# Altium schematic sheet DW3000.SchDoc
size 254 x 203 mm
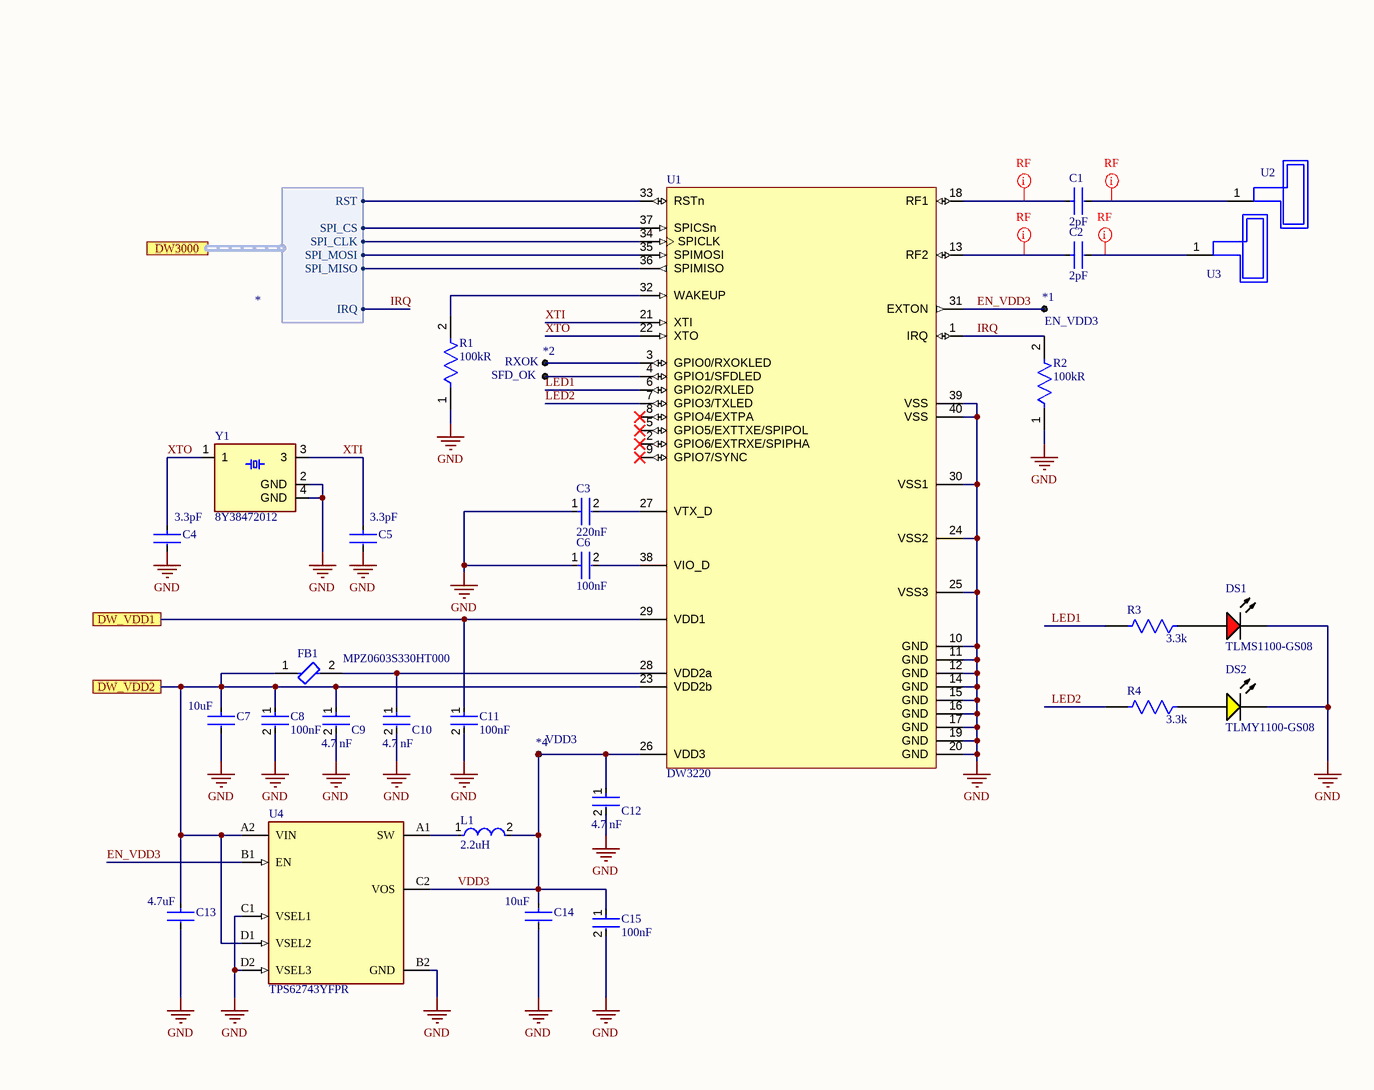
[diagram p0: DW3000.SchDoc]

## Parts
*1  EN_VDD3  [Pad-0.6mm]  (no BOM)
*2  RXOK  [Pad-1mm]  (no BOM)
*3  SFD_OK  [Pad-1mm]  (no BOM)
*4  VDD3  [Pad-0.6mm]  (no BOM)
C1  Capacitance: 2pF  [FP-GJM033-0_03-IPC_B]  (hidden comment: GJM0335C1E2R0WB01D)
C2  Capacitance: 2pF  [FP-GJM033-0_03-IPC_B]  (hidden comment: GJM0335C1E2R0WB01D)
C3  Capacitance: 220nF  [FP-GRM155-0_05-IPC_C]  (hidden comment: GRM155R71C224KA12D)
C4  Capacitance: 3.3pF  [FP-GJM155-0_05-IPC_C]  (hidden comment: GJM1555C1H3R3BB01D)
C5  Capacitance: 3.3pF  [FP-GJM155-0_05-IPC_C]  (hidden comment: GJM1555C1H3R3BB01D)
C6  Capacitance: 100nF  [FP-GRM155-0_05-IPC_B]  (hidden comment: GRM155R71E104ME14D)
C7  Capacitance: 10uF  [FP-GRM155-0_2-0_1-IPC_C]  (hidden comment: GRM155R60J106ME47D)
C8  Capacitance: 100nF  [FP-GRM155-0_05-IPC_B]  (hidden comment: GRM155R71E104ME14D)
C9  Parameter 1: 4.7 nF  [FP-GRM155-0_15-IPC_B]  (hidden comment: GRM1555C1H472GE01D)
C10  Parameter 1: 4.7 nF  [FP-GRM155-0_15-IPC_B]  (hidden comment: GRM1555C1H472GE01D)
C11  Capacitance: 100nF  [FP-GRM155-0_05-IPC_B]  (hidden comment: GRM155R71E104ME14D)
C12  Parameter 1: 4.7 nF  [FP-GRM155-0_15-IPC_B]  (hidden comment: GRM1555C1H472GE01D)
C13  Capacitance: 4.7uF  [FP-GRM155-0_15-IPC_B]  (hidden comment: GRM155C80J475MEAAD)
C14  Capacitance: 10uF  [FP-GRM155-0_2-0_1-IPC_C]  (hidden comment: GRM155R60J106ME47D)
C15  Capacitance: 100nF  [FP-GRM155-0_05-IPC_B]  (hidden comment: GRM155R71E104ME14D)
DS1  TLMS1100-GS08  [VISH-TLMX1100_V]
DS2  TLMY1100-GS08  [VISH-TLMX1100-2_V]
FB1  MPZ0603S330HT000  [FP-MPZ0603-IPC_B]
L1  Inductance: 2.2uH  [FP-DFE201610C-IPC_C]  (hidden comment: 1285AS-H-2R2M=P2)
R1  Resistance: 100kR  [FP-CRCW0402-e3-IPC_C]  (hidden comment: CRCW0402100KFKED)
R2  Resistance: 100kR  [FP-CRCW0402-e3-IPC_C]  (hidden comment: CRCW0402100KFKED)
R3  Resistance: 3.3k  [FP-CRCW0402-e3-IPC_C]
R4  Resistance: 3.3k  [FP-CRCW0402-e3-IPC_C]
U1  DW3220  [QFN40P500X500X40_HS-40N]
U2  AH086M555003-T  [AH086M]  (value not drawn)
U3  AH086M555003-T  [AH086M]  (value not drawn)
U4  TPS62743YFPR  [FP-YFP0008-C01-MFG]
Y1  8Y38472012  [OSCSC320X250X100N]

## Ports
DW3000 (harness *), DW_VDD1, DW_VDD2

## Harnesses
*: SPI_CS, SPI_CLK, SPI_MOSI, SPI_MISO, RST, IRQ

## Nets
GND: C3.1 C4.2 C5.2 C6.1 C7.2 C8.2 C9.2 C10.2 C11.2 C12.2 C13.2 C14.2 C15.2 DS1.2(K) DS2.2(K) R1.1 R2.1 U1.10(GND) U1.11(GND) U1.12(GND) U1.14(GND) U1.15(GND) U1.16(GND) U1.17(GND) U1.19(GND) U1.20(GND) U1.24(VSS2) U1.25(VSS3) U1.30(VSS1) U1.39(VSS) U1.40(VSS) U4.B2(GND) U4.C1(VSEL1) U4.D2(VSEL3) Y1.2(GND) Y1.4(GND)
DW_VDD1: C11.1 U1.29(VDD1) ; port DW_VDD1
DW_VDD2: C7.1 C8.1 C9.1 C13.1 FB1.1 U1.23(VDD2b) U4.A2(VIN) U4.D1(VSEL2) ; port DW_VDD2
EN_VDD3: *1.1 U1.31(EXTON) U4.B1(EN)
IRQ: R2.2 U1.1(IRQ) ; port DW3000.IRQ
LED1: R3.2 U1.6(GPIO2/RXLED)
LED2: R4.2 U1.7(GPIO3/TXLED)
VDD3: *4.1 C12.1 C14.1 C15.1 L1.2 U1.26(VDD3) U4.C2(VOS)
XTI: C5.1 U1.21(XTI) Y1.3
XTO: C4.1 U1.22(XTO) Y1.1
Net*2_1: *2.1 U1.3(GPIO0/RXOKLED)
Net*3_1: *3.1 U1.4(GPIO1/SFDLED)
NetC1_1: C1.1 U1.18(RF1)
NetC1_2: C1.2 U2.1
NetC2_1: C2.1 U1.13(RF2)
NetC2_2: C2.2 U3.1
NetC3_2: C3.2 U1.27(VTX_D)
NetC6_2: C6.2 U1.38(VIO_D)
NetC10_1: C10.1 FB1.2 U1.28(VDD2a)
NetDS1_1: DS1.1(A) R3.1
NetDS2_1: DS2.1(A) R4.1
NetL1_1: L1.1 U4.A1(SW)
NetR1_2: R1.2 U1.32(WAKEUP)
NetU1_33: U1.33(RSTn) ; port DW3000.RST
NetU1_34: U1.34(SPICLK) ; port DW3000.SPI_CLK
NetU1_35: U1.35(SPIMOSI) ; port DW3000.SPI_MOSI
NetU1_36: U1.36(SPIMISO) ; port DW3000.SPI_MISO
NetU1_37: U1.37(SPICSn) ; port DW3000.SPI_CS

Not connected (* = marked no-connect by the designer): U1 2(GPIO6/EXTRXE/SPIPHA)* 5(GPIO5/EXTTXE/SPIPOL)* 8(GPIO4/EXTPA)* 9(GPIO7/SYNC)*

## Layout directives
net class RF: NetC1_1, NetC1_2, NetC2_1, NetC2_2

## Notes on the sheet
- 1
- 2
- 3
- 4
- A
- B
- C
- Project:
- D
- Date:
- Drawing number:
- Rev:
- Format:
- A4 Q
- Drawn by:
- Laboratory:
- Page
- Sheet:
- of
- File:

## Library data of the parts
*1 *4 = CMP-00224-1: 0.6mm SMT Test Pad; Mounting Technology: SMT
*2 *3 = CMP-01283-1: 1mm SMT Test Pad; Mounting Technology: SMT
C1 C2 = CMP-2010-00751-2: Ceramic Capacitor 2pF ±0.05pF 25V C0G 0201 (0603 Metric); Package Quantity: 15000; Min Operating Temperature: -55°C; Thickness: 0.013inch; Max Operating Temperature: 125°C; Voltage Rating: 25V; Voltage Rating (DC): 25V; Packaging: Tape and Reel; Width: 0.012inch; Length: 0.6mm; Height: 0.3mm; Mount: Surface Mount; Case Code (Imperial): 0201; Radiation Hardening: No; Dielectric: C0G; Termination: SMD/SMT; Case Code (Metric): 0603; Case/Package: 0201; Depth: 0.3mm
C3 = CMP-1034-02089-3: Chip Multilayer Ceramic Capacitors for General Purpose, 0402, 0.22uF, X7R, 15%, 10%, 16V; Depth: 0.5mm; Dielectric: X7R; Min Operating Temperature: -55°C; Package Quantity: 1; Termination: SMD/SMT; Mount: Surface Mount; Radiation Hardening: No; Height: 0.5mm; Case Code (Metric): 1005; Packaging: Tape and Reel; Material: Ceramic; Voltage: 16V; Voltage Rating (DC): 16V; REACH SVHC: No SVHC; Voltage Rating: 16V; Length: 1mm; Tolerance: 10%; Thickness: 0.022inch; Case Code (Imperial): 0402; Max Operating Temperature: 125°C; Width: 0.02inch; Lead Free: Lead Free; Case/Package: 0402
C4 C5 = CMP-2008-03846-2: Multi-Layer Ceramic Capacitor 3.3pF C0G  ±0.1pF 0402 Paper T/R; Voltage: 50V; Lead Free: Lead Free; Thickness: 0.022inch; Mount: Surface Mount; Termination: SMD/SMT; Package Quantity: 1; Lead Pitch: 0.3mm; Case/Package: 0402; REACH SVHC: No SVHC; Case Code (Imperial): 0402; Number of Pins: 2; Height: 0.5mm; Width: 0.5mm; Depth: 0.5mm; Packaging: Tape and Reel; Min Operating Temperature: -55°C; Length: 1mm; Dielectric: C0G; Case Code (Metric): 1005; Max Operating Temperature: 125°C; Voltage Rating (DC): 50V; Voltage Rating: 50V; Radiation Hardening: No
C6 C8 C11 C15 = CMP-06035-053616-1: Chip Multilayer Ceramic Capacitors for General Purpose, 0402, 0.10uF, X7R, 15%, 20%, 25V; Dielectric: X7R; Width: 0.5mm; Case/Package: 0402; Package Quantity: 10000; Lead Free: Lead Free; Voltage Rating (DC): 25V; Max Operating Temperature: 125°C; Depth: 0.5mm; Packaging: Tape and Reel; Length: 1mm; Case Code (Metric): 1005; Tolerance: 20%; Case Code (Imperial): 0402; Thickness: 0.022inch; Material: Ceramic; Voltage Rating: 25V; Weight: 0.000212oz; Min Operating Temperature: -55°C; Termination: SMD/SMT; Mount: Surface Mount; Resistor Type: Ceramic; Height: 0.5mm
C7 C14 = CMP-06035-022355-1: Chip Multilayer Ceramic Capacitors for General Purpose, 0402, 10uF, X5R, 15%, 20%, 6.3V; Mount: Surface Mount; Tolerance: 20%; Width: 0.02inch; Voltage Rating: 6.3V; Length: 0.039inch; Case Code (Imperial): 0402; Voltage Rating (DC): 6.3V; Max Operating Temperature: 85°C; Thickness: 0.024inch; Min Operating Temperature: -55°C; Packaging: Tape and Reel; Case/Package: 0402; Dielectric: X5R; Case Code (Metric): 1005
C9 C10 C12 = CMP-06035-019672-1: Chip Multilayer Ceramic Capacitors for General Purpose, 0402, 4700pF, C0G, 30ppm/°C, 2%, 50V
C13 = CMP-06035-032730-1: Chip Multilayer Ceramic Capacitors for General Purpose, 0402, 4.7uF, X6S, 22%, 20%, 6.3V; Dielectric: X6S; Length: 1mm; Tolerance: 20%; Voltage Rating (DC): 6.3V; Width: 500um; Thickness: 500um
DS1 = CMP-1666-00027-1: LED, RED, 2.1 V, -40 to 100 degC, 2-Pin SMD (0603), RoHS, Tape and Reel; Type (Capacitors): C0G; Resistance: 100000000000 Ohm; Capacitance: 12 pF; Voltage Rating: 50 V; Tolerance: 5%; Min Operating Temperature: -55degC; REACH SVHC: No SVHC; ComponentLink2Description: Datasheet; ComponentLink1URL: http://www.vishay.com/; Width: 0.8 mm; Package Quantity: 4000; PackageReference: TLMX1100; ComponentLink2URL: http://www.vishay.com/docs/83173/tlmb1100.pdf; Case/Package: 0603; Case Code (Metric): 1608; Packaging: Tape and Reel; Pins: 2; ComponentLink1Description: Manufacturer URL; Max Operating Temperature: 125degC; Height: 0.8 mm; Length: 1.6 mm; Mount: Surface Mount; PackageDescription: 2-Pin Surface Mount Device, Body 1.6 x 0.8 mm; DatasheetVersion: Rev. 2.7, 03/2016; Case Code (Imperial): 0603; Voltage Rating (DC): 50 V; RoHSCompliant: True; Radiation Hardening: No
DS2 = CMP-1666-00030-1: Yellow LED, 20 mA, 2.1 V, -40 to 100 degC, 2-Pin SMD (0603), RoHS, Tape and Reel; ComponentLink2Description: Datasheet; ComponentLink2URL: http://download.siliconexpert.com/pdfs/2016/8/7/12/43/26/667/vsh_/manual/379263299541529tlmb1100.pdf; ComponentLink1Description: Manufacturer URL; PackageDescription: 2-Pin Surface Mount Device, Body 1.6 x 0.8 mm; DatasheetVersion: Rev. 2.7, 03/2016; ComponentLink1URL: http://www.vishay.com/; PackageReference: 0603
FB1 = CMP-08257-000038-1: CHIP BEADS FOR GENERAL SIGNAL LI; Number of Lines: 1; Max Current Rating: 1.6A; DC Resistance (DCR): 50mR; Case/Package: 0201; Min Operating Temperature: -55°C; Max Operating Temperature: 125°C; Mount: Surface Mount; RoHS Compliant: Yes; Packaging: Cut Tape; Case Code (Metric): 0603; Case Code (Imperial): 0201
L1 = CMP-06042-000201-1: Shielded Wirewound Inductor 2.2uH 20% 1200mA 0.204Ω 0806 (2016); DC Resistance (DCR): 204mR; Current Rating: 1.5A; Core Material: Ferrite; Max DC Current: 1.2A; Test Frequency: 1MHz; Height - Seated (Max): 0.039inch; Min Operating Temperature: -40°C; Width: 0.063inch; Packaging: Tape and Reel; Case Code (Imperial): 0805; Mount: Surface Mount; Shielding: Shielded; Resistor Type: Wirewound; Case Code (Metric): 2012; Max Operating Temperature: 85°C; Depth: 1.6mm; Case/Package: 0805; Length: 0.079inch; Tolerance: 20%
R1 R2 = CMP-2002-08123-3: RES Thick Film, 100kΩ, 1%, 0.063W, 100ppm/°C, 0402; Power Rating: 63mW; Voltage Rating (DC): 50V; Lead Free: Lead Free; Height: 0.35mm; Contact Plating: Tin; Min Operating Temperature: -55°C; Package Quantity: 10000; Case/Package: 0402; Temperature Coefficient: 100ppm/°C; Number of Terminations: 2; Packaging: Tape and Reel; Max Power Dissipation: 63mW; Case Code (Metric): 1005; Mount: Surface Mount; Width: 0.02inch; Termination: SMD/SMT; Length: 1mm; Number of Pins: 2; Weight: 2.3E-05oz; Radiation Hardening: No; Tolerance: 1%; Military Standard: Not; Features: Automotive AEC-Q200; Depth: 0.5mm; Composition: Thick Film; Max Operating Temperature: 155°C; Voltage Rating: 50V; Case Code (Imperial): 0402
R3 R4 = CMP-2002-08123-3: RES Thick Film, 3.3kΩ, 1%, 0.063W, 100ppm/°C, 0402; Power Rating: 63mW; Voltage Rating (DC): 50V; Lead Free: Lead Free; Height: 0.35mm; Contact Plating: Tin; Min Operating Temperature: -55°C; Package Quantity: 10000; Case/Package: 0402; Temperature Coefficient: 100ppm/°C; Number of Terminations: 2; Packaging: Tape and Reel; Max Power Dissipation: 63mW; Case Code (Metric): 1005; Mount: Surface Mount; Width: 0.02inch; Termination: SMD/SMT; Length: 1mm; Number of Pins: 2; Weight: 2.3E-05oz; Radiation Hardening: No; Tolerance: 1%; Military Standard: Not; Features: Automotive AEC-Q200; Depth: 0.5mm; Composition: Thick Film; Max Operating Temperature: 155°C; Voltage Rating: 50V; Case Code (Imperial): 0402
U1 = CMP-01416-1: Ultra-low power Wi-Fi 802.11b/g/n, without mounted antenna; Manufacturer: Qorvo; Part # Aliases: DWM3000; Interface: SPI; MCU: External; Antenna Ports(#): 2; Data Rate: 850 kbps, 6.8 Mbps; 802.15 Standards: 4a, 4z-BPRF; Package(mm): 5 x 5; PDoA Support: Yes; Ranging Accuracy(cm): < 10; Security Features: 4z Compliant + AES; Voltage(V): 2.4 to 3.6; Angle of Arrival(degrees): < 5; UWB Channels: 5, 9; BOM Ext Components(#): 10; Product Type: RF Transceiver; Series: DWM3000; Package Type: QFN; Subcategory: Wireless & RF Integrated Circuits
U2 U3 = CMP-00997-1: 3.5GHz, 5.6GHz WiMax™ Chip RF Antenna 3.1GHz ~ 8GHz 2.6dBi, 0.7dBi Solder Surface Mount; Frequency: 5.55GHz; Impedance: 50R; Number of Bands: 1; Mount: Surface Mount; Min Operating Temperature: -20°C; Max Operating Temperature: 80°C; Packaging: Tape and Reel; Package Quantity: 1; Termination: Solder; Max Frequency: 8GHz; Length: 8mm; Height: 0.039inch; Width: 6mm; Radiation Hardening: No; REACH SVHC: Unknown
U4 = CMP-04918-000507-1: IC REG BUCK PROG 300MA 8DSBGA; Output Configuration: Positive; Switching Frequency: 1.2MHz; Number of Outputs: 1; Min Input Voltage: 2.15V; Min Output Voltage: 1.2V; Max Input Voltage: 5.5V; Synchronous Rectifier: Yes; Max Output Voltage: 3.3V; Quiescent Current: 300nA; Max Operating Temperature: 85°C; Lead Free: Lead Free; Min Operating Temperature: -40°C; Packaging: Tape and Reel; RoHS Compliant: Yes; Mount: Surface Mount; Output Current: 300mA
Y1 = ABM8G-14.31818MHZ-B4Y-T: Crystal 38.4MHz ±10ppm (Stability) 10pF FUND 80Ohm 4-Pin Mini-CSMD T/R; Package: None; Price: None; Value: 38.4 MHz; MP: 8Y38472012; Availability: Unavailable; ComponentLink1Description: Digikey; ComponentLink1URL: https://www.digikey.ch/en/products/detail/txc-corporation/8Y38472012/10492155